# EAGLE design TeensyAmp_R4.2 (EAGLE 9.6.2)

## Sheet 1 of 3
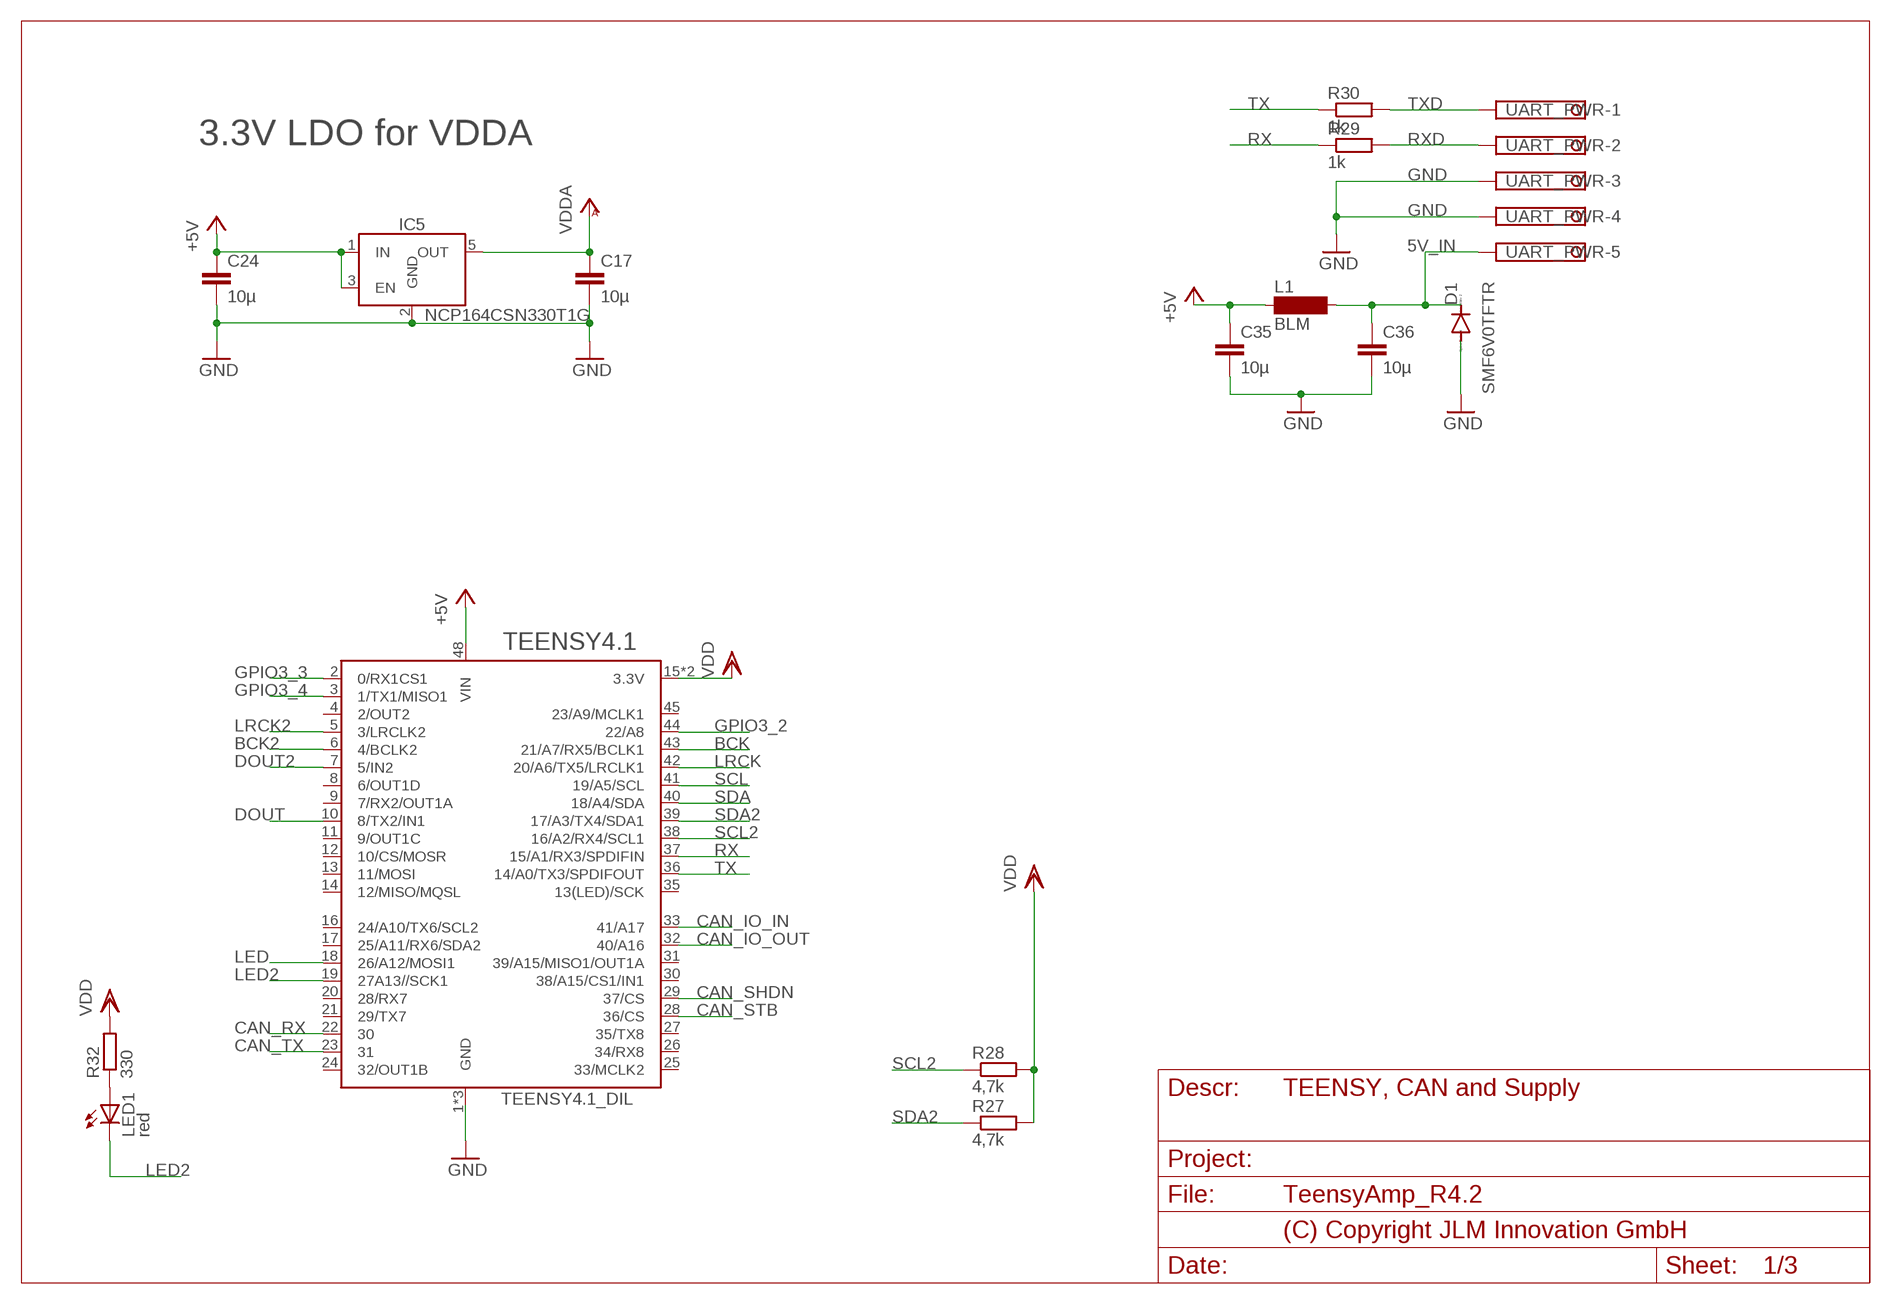
[diagram p0: schematic, sheet 1]
FRAME2 (DINA4_L): PAGE_DESCRIPTION: TEENSY, CAN and Supply

### Parts
C17  10µ  C-EUC0603  [C0603]
C24  10µ  C-EUC0603  [C0603]
C35  10µ  C-EUC0805  [C0805]
C36  10µ  C-EUC0805  [C0805]
D1  SMF6V0TFTR  DIODE-SOD123  [SOD123]
IC5  NCP164CSN330T1G  LDO_ENSOT23-5  [SOT23-5]
L1  BLM  L_JLM0805  [R0805]
LED1  red  LED5MM  [LED5MM]
R27  4,7k  R_JLMR0603  [R0603]
R28  4,7k  R_JLMR0603  [R0603]
R29  1k  R_JLMR0603  [R0603]
R30  1k  R_JLMR0603  [R0603]
R32  330  R_JLMR0603  [R0603]
TEENSY4.1  TEENSY4.1_DIL  [TEENSY4.1_DIL]
UART_PWR  1751277  [1751277]

### Nets
5V_IN: C36.1 D1.C L1.2 UART_PWR.5
+5V: C24.1 C35.1 IC5.1(IN) IC5.3(EN) L1.1 TEENSY4.1.48(VIN)
BCK: TEENSY4.1.43(21/A7/RX5/BCLK1)
BCK2: TEENSY4.1.6(4/BCLK2) ; also sheet 2,3
CAN_IO_IN: TEENSY4.1.33(41/A17)
CAN_IO_OUT: TEENSY4.1.32(40/A16)
CAN_RX: TEENSY4.1.22
CAN_SHDN: TEENSY4.1.29(37/CS)
CAN_STB: TEENSY4.1.28(36/CS)
CAN_TX: TEENSY4.1.23
DOUT: TEENSY4.1.10(8/TX2/IN1)
DOUT2: TEENSY4.1.7(5/IN2) ; also sheet 2,3
GND: C17.2 C24.2 C35.2 C36.2 D1.A IC5.2(GND) TEENSY4.1.1(GND) TEENSY4.1.34(GND) TEENSY4.1.47(GND) UART_PWR.3 UART_PWR.4 ; also sheet 2,3
GPIO3_2: TEENSY4.1.44(22/A8)
GPIO3_3: TEENSY4.1.2(0/RX1CS1) ; also sheet 2
GPIO3_4: TEENSY4.1.3(1/TX1/MISO1) ; also sheet 3
LED: TEENSY4.1.18(26/A12/MOSI1)
LED2: LED1.K(C) TEENSY4.1.19(27A13//SCK1)
LRCK: TEENSY4.1.42(20/A6/TX5/LRCLK1)
LRCK2: TEENSY4.1.5(3/LRCLK2) ; also sheet 2,3
N$71: LED1.A R32.1
RX: R29.1 TEENSY4.1.37(15/A1/RX3/SPDIFIN)
RXD: R29.2 UART_PWR.2
SCL: TEENSY4.1.41(19/A5/SCL)
SCL2: R28.1 TEENSY4.1.38(16/A2/RX4/SCL1) ; also sheet 2,3
SDA: TEENSY4.1.40(18/A4/SDA)
SDA2: R27.1 TEENSY4.1.39(17/A3/TX4/SDA1) ; also sheet 2,3
TX: R30.1 TEENSY4.1.36(14/A0/TX3/SPDIFOUT)
TXD: R30.2 UART_PWR.1
VDD: R27.2 R28.2 R32.2 TEENSY4.1.15(3.3V) TEENSY4.1.46(3.3V) ; also sheet 2,3
VDDA: C17.1 IC5.5(OUT) ; also sheet 2,3
Unconnected: TEENSY4.1.4(2/OUT2) TEENSY4.1.8(6/OUT1D) TEENSY4.1.9(7/RX2/OUT1A) TEENSY4.1.11(9/OUT1C) TEENSY4.1.12(10/CS/MOSR) TEENSY4.1.13(11/MOSI) TEENSY4.1.14(12/MISO/MQSL) TEENSY4.1.16(24/A10/TX6/SCL2) TEENSY4.1.17(25/A11/RX6/SDA2) TEENSY4.1.20(28/RX7) TEENSY4.1.21(29/TX7) TEENSY4.1.24(32/OUT1B) TEENSY4.1.25(33/MCLK2) TEENSY4.1.26(34/RX8) TEENSY4.1.27(35/TX8) TEENSY4.1.30(38/A15/CS1/IN1) TEENSY4.1.31(39/A15/MISO1/OUT1A) TEENSY4.1.35(13(LED)/SCK) TEENSY4.1.45(23/A9/MCLK1)

### Notes on the sheet
- 3.3V LDO for VDDA

## Sheet 2 of 3
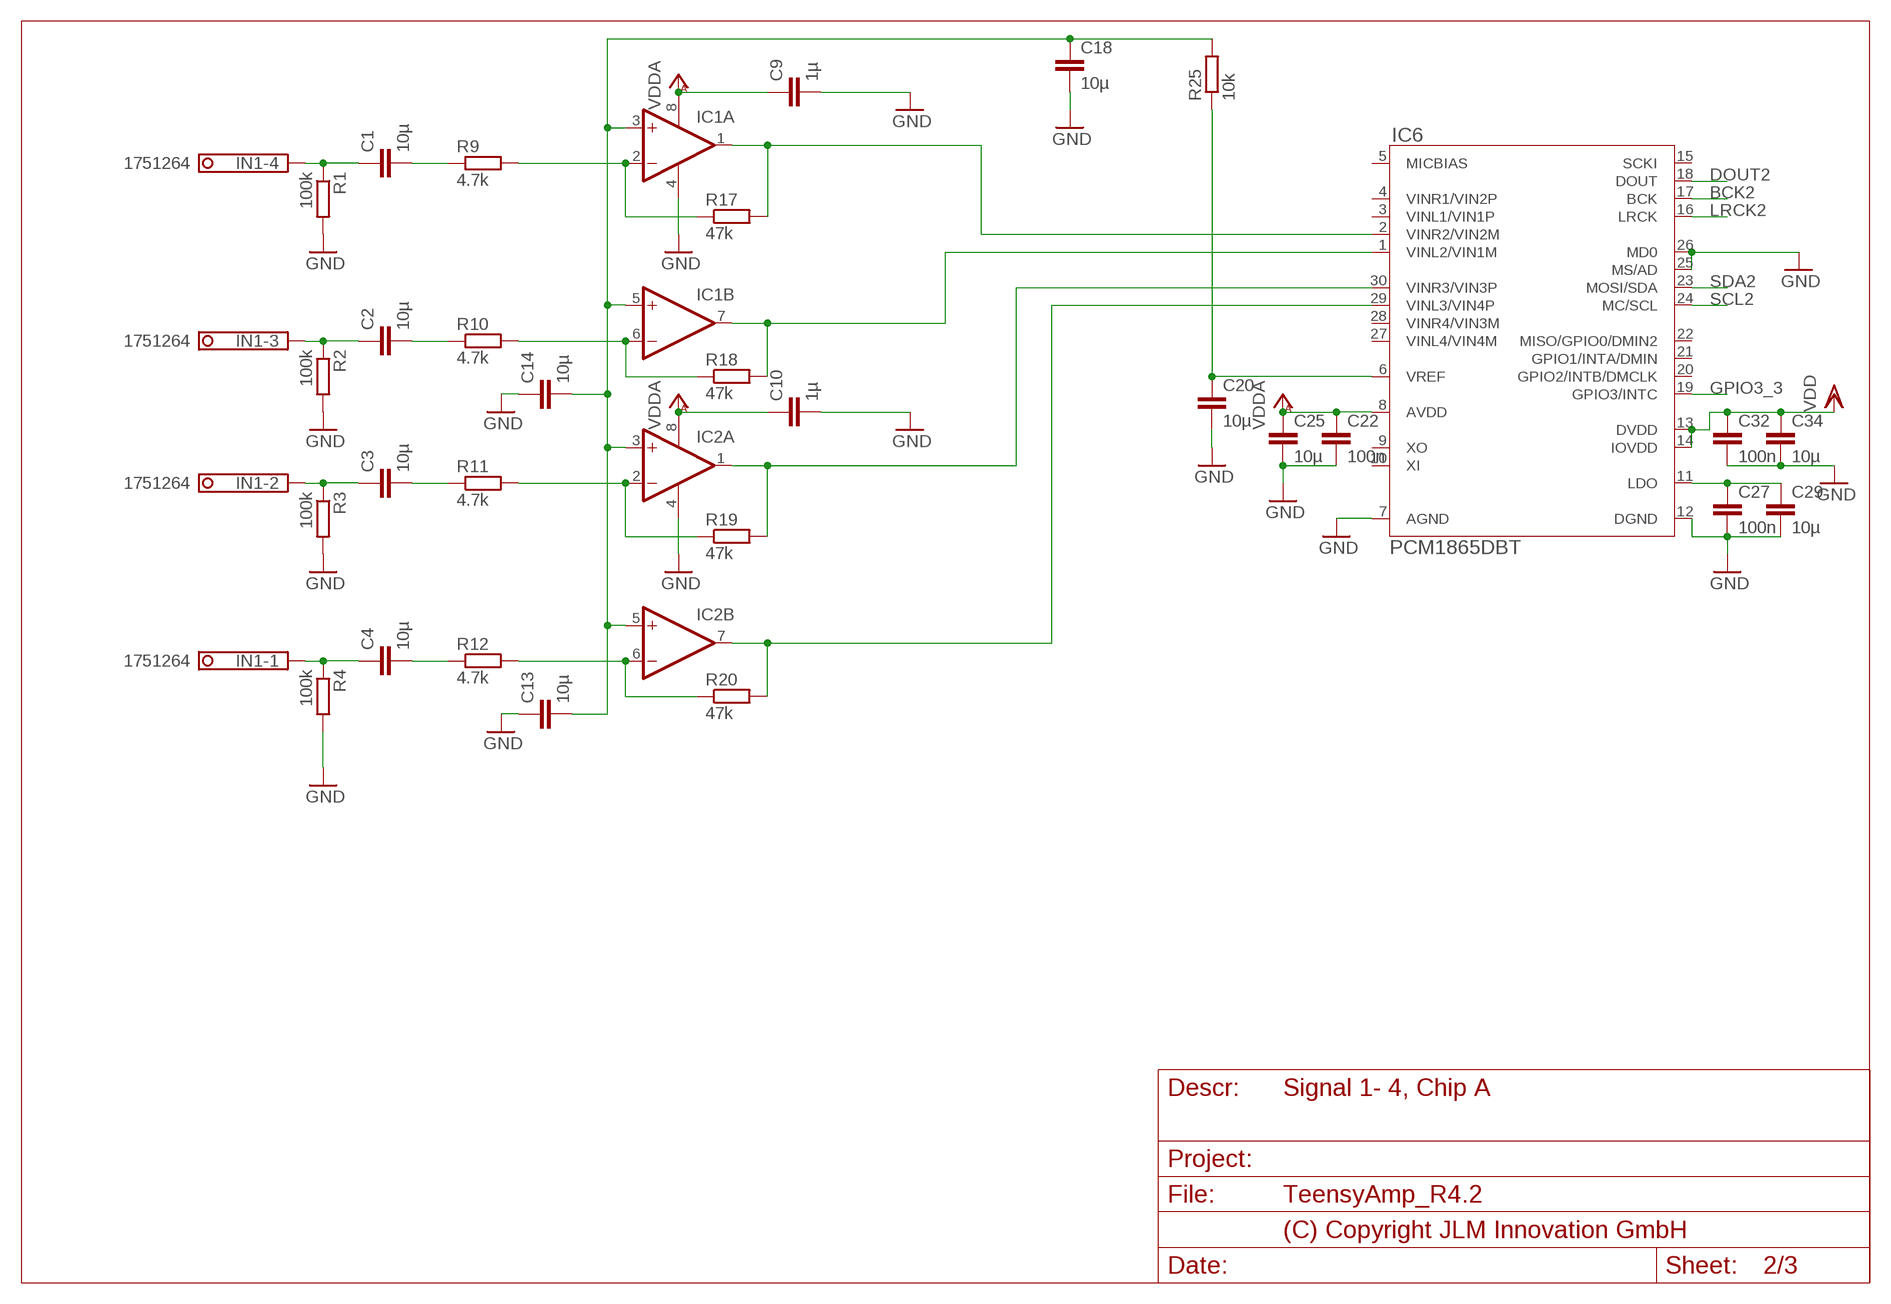
[diagram p1: schematic, sheet 2]
FRAME1 (DINA4_L): PAGE_DESCRIPTION: Signal 1- 4, Chip A

### Parts
C1  10µ  C-EUC0805  [C0805]
C2  10µ  C-EUC0805  [C0805]
C3  10µ  C-EUC0805  [C0805]
C4  10µ  C-EUC0805  [C0805]
C9  1µ  C-EUC0603  [C0603]
C10  1µ  C-EUC0603  [C0603]
C13  10µ  C-EUC0603  [C0603]
C14  10µ  C-EUC0603  [C0603]
C18  10µ  C-EUC0603  [C0603]
C20  10µ  C-EUC0603  [C0603]
C22  100n  C-EUC0603  [C0603]
C25  10µ  C-EUC0603  [C0603]
C27  100n  C-EUC0603  [C0603]
C29  10µ  C-EUC0603  [C0603]
C32  100n  C-EUC0603  [C0603]
C34  10µ  C-EUC0603  [C0603]
IC1  OPA2344E  [MSOP08]
IC2  OPA2344E  [MSOP08]
IC6  PCM1865DBT  [SOP50P640X120-30N]
IN1  1751264  [1751264]
R1  100k  R_JLMR0603  [R0603]
R2  100k  R_JLMR0603  [R0603]
R3  100k  R_JLMR0603  [R0603]
R4  100k  R_JLMR0603  [R0603]
R9  4.7k  R_JLMR0603  [R0603]
R10  4.7k  R_JLMR0603  [R0603]
R11  4.7k  R_JLMR0603  [R0603]
R12  4.7k  R_JLMR0603  [R0603]
R17  47k  R_JLMR0603  [R0603]
R18  47k  R_JLMR0603  [R0603]
R19  47k  R_JLMR0603  [R0603]
R20  47k  R_JLMR0603  [R0603]
R25  10k  R_JLMR0603  [R0603]

### Nets
BCK2: IC6.17(BCK) ; also sheet 1,3
DOUT2: IC6.18(DOUT) ; also sheet 1,3
GND: C9.2 C10.2 C13.1 C14.1 C18.2 C20.2 C22.2 C25.2 C27.2 C29.2 C32.2 C34.2 IC1.4(A:V-) IC2.4(A:V-) IC6.7(AGND) IC6.12(DGND) IC6.25(MS/AD) IC6.26(MD0) R1.2 R2.2 R3.2 R4.2 ; also sheet 1,3
GPIO3_3: IC6.19(GPIO3/INTC) ; also sheet 1
LRCK2: IC6.16(LRCK) ; also sheet 1,3
N$11: C27.1 C29.1 IC6.11(LDO)
N$16: C4.1 IN1.1 R4.1
N$18: C3.1 IN1.2 R3.1
N$19: C2.1 IN1.3 R2.1
N$21: C1.1 IN1.4 R1.1
N$23: C2.2 R10.1
N$24: C3.2 R11.1
N$25: C1.2 R9.1
N$26: C4.2 R12.1
N$28: IC1.1(A:OUT) IC6.2(VINR2/VIN2M) R17.2
N$29: IC1.7(B:OUT) IC6.1(VINL2/VIN1M) R18.2
N$30: IC2.1(A:OUT) IC6.30(VINR3/VIN3P) R19.2
N$31: IC1.2(A:-IN) R9.2 R17.1
N$32: IC1.6(B:-IN) R10.2 R18.1
N$33: IC2.2(A:-IN) R11.2 R19.1
N$34: IC2.6(B:-IN) R12.2 R20.1
N$35: IC2.7(B:OUT) IC6.29(VINL3/VIN4P) R20.2
N$37: C20.1 IC6.6(VREF) R25.1
N$74: C13.2 C14.2 C18.1 IC1.3(A:+IN) IC1.5(B:+IN) IC2.3(A:+IN) IC2.5(B:+IN) R25.2
SCL2: IC6.24(MC/SCL) ; also sheet 1,3
SDA2: IC6.23(MOSI/SDA) ; also sheet 1,3
VDD: C32.1 C34.1 IC6.13(DVDD) IC6.14(IOVDD) ; also sheet 1,3
VDDA: C9.1 C10.1 C22.1 C25.1 IC1.8(A:V+) IC2.8(A:V+) IC6.8(AVDD) ; also sheet 1,3
Unconnected: IC6.3(VINL1/VIN1P) IC6.4(VINR1/VIN2P) IC6.5(MICBIAS) IC6.9(XO) IC6.10(XI) IC6.15(SCKI) IC6.20(GPIO2/INTB/DMCLK) IC6.21(GPIO1/INTA/DMIN) IC6.22(MISO/GPIO0/DMIN2) IC6.27(VINL4/VIN4M) IC6.28(VINR4/VIN3M)

## Sheet 3 of 3
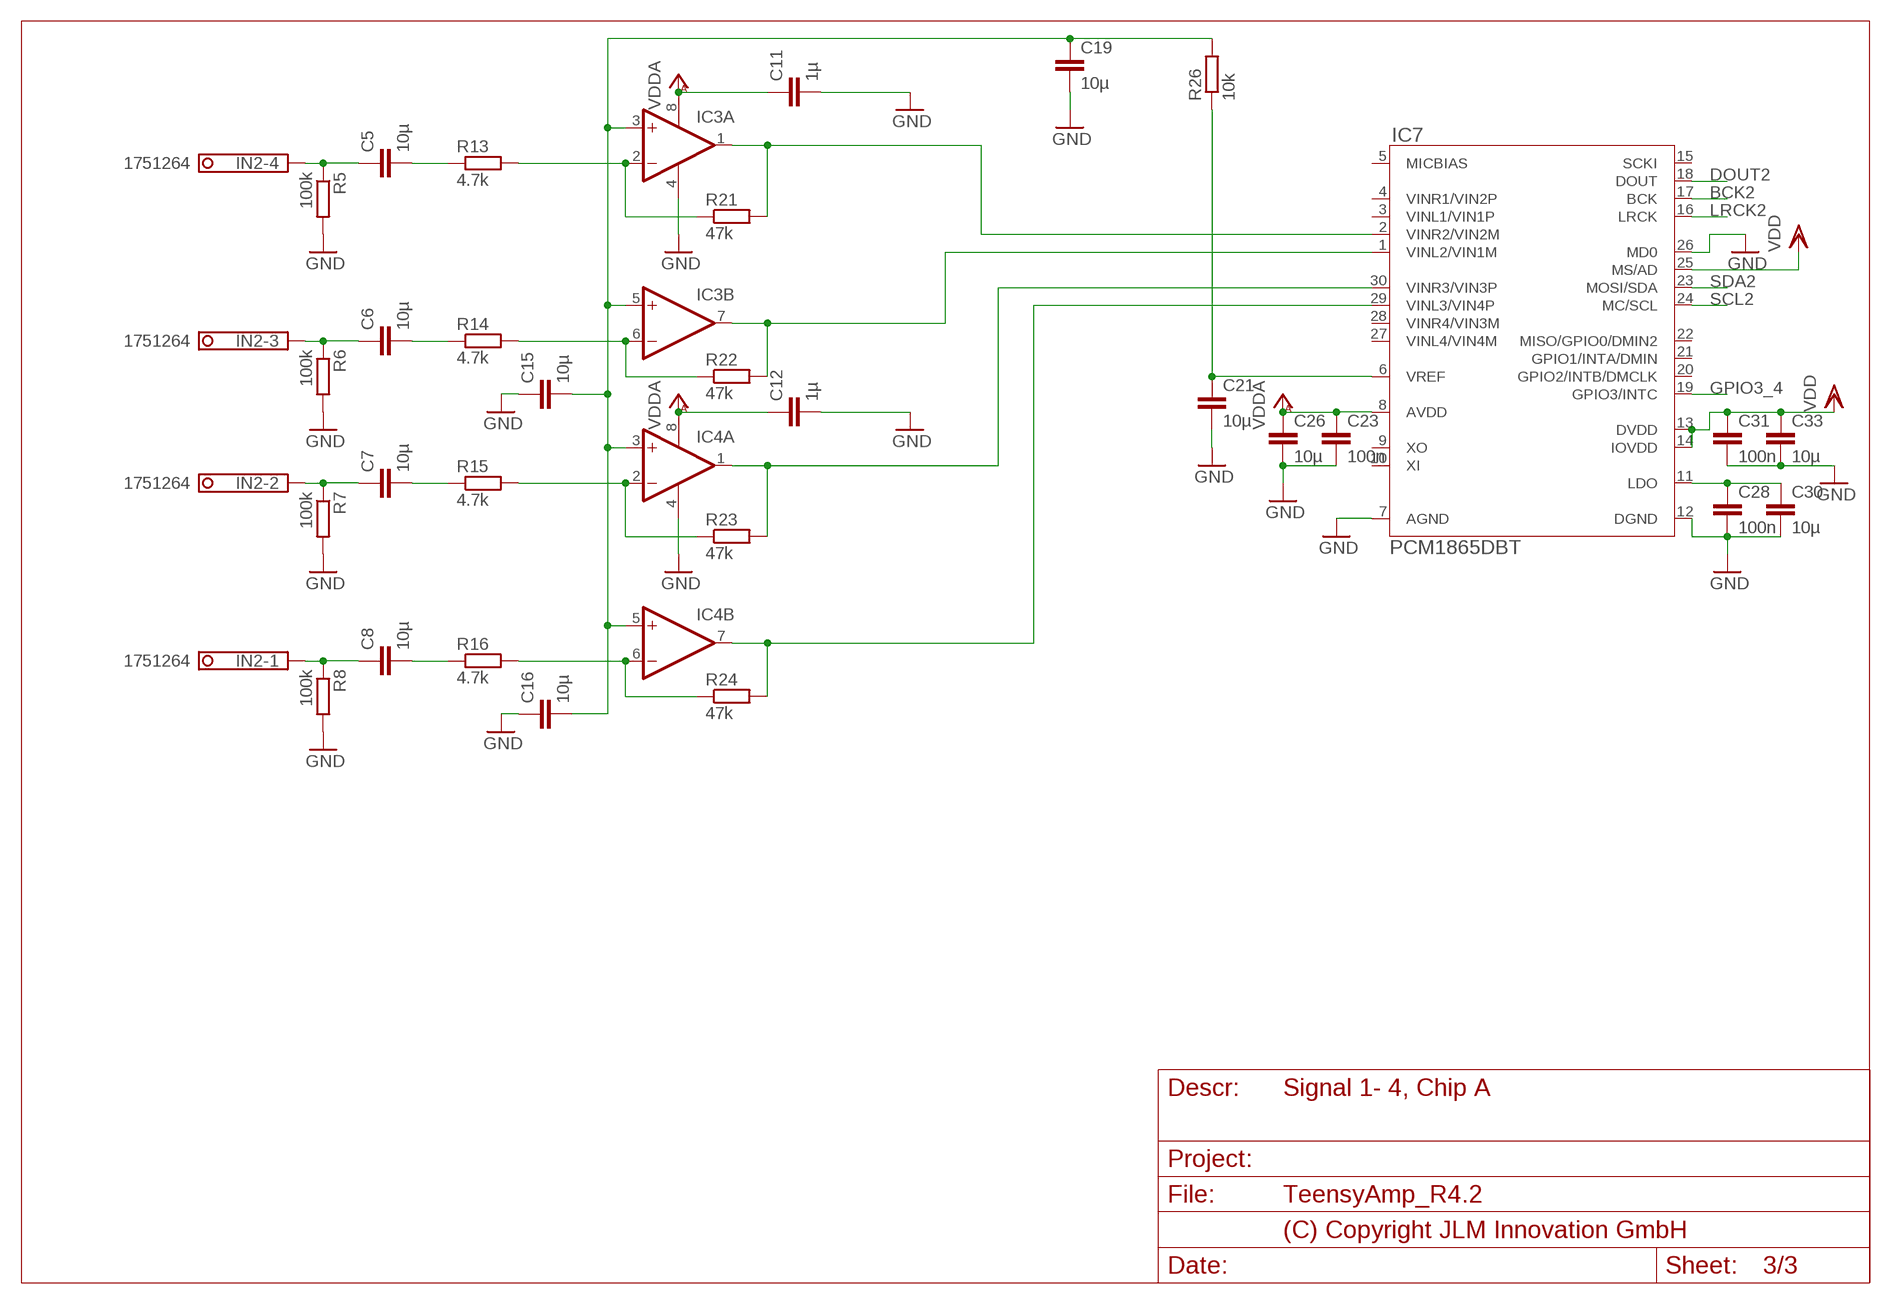
[diagram p2: schematic, sheet 3]
FRAME3 (DINA4_L): PAGE_DESCRIPTION: Signal 1- 4, Chip A

### Parts
C5  10µ  C-EUC0805  [C0805]
C6  10µ  C-EUC0805  [C0805]
C7  10µ  C-EUC0805  [C0805]
C8  10µ  C-EUC0805  [C0805]
C11  1µ  C-EUC0603  [C0603]
C12  1µ  C-EUC0603  [C0603]
C15  10µ  C-EUC0603  [C0603]
C16  10µ  C-EUC0603  [C0603]
C19  10µ  C-EUC0603  [C0603]
C21  10µ  C-EUC0603  [C0603]
C23  100n  C-EUC0603  [C0603]
C26  10µ  C-EUC0603  [C0603]
C28  100n  C-EUC0603  [C0603]
C30  10µ  C-EUC0603  [C0603]
C31  100n  C-EUC0603  [C0603]
C33  10µ  C-EUC0603  [C0603]
IC3  OPA2344E  [MSOP08]
IC4  OPA2344E  [MSOP08]
IC7  PCM1865DBT  [SOP50P640X120-30N]
IN2  1751264  [1751264]
R5  100k  R_JLMR0603  [R0603]
R6  100k  R_JLMR0603  [R0603]
R7  100k  R_JLMR0603  [R0603]
R8  100k  R_JLMR0603  [R0603]
R13  4.7k  R_JLMR0603  [R0603]
R14  4.7k  R_JLMR0603  [R0603]
R15  4.7k  R_JLMR0603  [R0603]
R16  4.7k  R_JLMR0603  [R0603]
R21  47k  R_JLMR0603  [R0603]
R22  47k  R_JLMR0603  [R0603]
R23  47k  R_JLMR0603  [R0603]
R24  47k  R_JLMR0603  [R0603]
R26  10k  R_JLMR0603  [R0603]

### Nets
BCK2: IC7.17(BCK) ; also sheet 1,2
DOUT2: IC7.18(DOUT) ; also sheet 1,2
GND: C11.2 C12.2 C15.1 C16.1 C19.2 C21.2 C23.2 C26.2 C28.2 C30.2 C31.2 C33.2 IC3.4(A:V-) IC4.4(A:V-) IC7.7(AGND) IC7.12(DGND) IC7.26(MD0) R5.2 R6.2 R7.2 R8.2 ; also sheet 1,2
GPIO3_4: IC7.19(GPIO3/INTC) ; also sheet 1
LRCK2: IC7.16(LRCK) ; also sheet 1,2
N$43: C28.1 C30.1 IC7.11(LDO)
N$48: IC3.2(A:-IN) R13.2 R21.1
N$49: IC3.6(B:-IN) R14.2 R22.1
N$50: IC4.2(A:-IN) R15.2 R23.1
N$51: IC4.6(B:-IN) R16.2 R24.1
N$52: C6.2 R14.1
N$53: C7.2 R15.1
N$54: C8.2 R16.1
N$55: C5.2 R13.1
N$56: C8.1 IN2.1 R8.1
N$57: C7.1 IN2.2 R7.1
N$58: C6.1 IN2.3 R6.1
N$59: C5.1 IN2.4 R5.1
N$65: C21.1 IC7.6(VREF) R26.1
N$66: IC4.1(A:OUT) IC7.30(VINR3/VIN3P) R23.2
N$67: IC3.7(B:OUT) IC7.1(VINL2/VIN1M) R22.2
N$68: IC3.1(A:OUT) IC7.2(VINR2/VIN2M) R21.2
N$69: IC4.7(B:OUT) IC7.29(VINL3/VIN4P) R24.2
N$70: C15.2 C16.2 C19.1 IC3.3(A:+IN) IC3.5(B:+IN) IC4.3(A:+IN) IC4.5(B:+IN) R26.2
SCL2: IC7.24(MC/SCL) ; also sheet 1,2
SDA2: IC7.23(MOSI/SDA) ; also sheet 1,2
VDD: C31.1 C33.1 IC7.13(DVDD) IC7.14(IOVDD) IC7.25(MS/AD) ; also sheet 1,2
VDDA: C11.1 C12.1 C23.1 C26.1 IC3.8(A:V+) IC4.8(A:V+) IC7.8(AVDD) ; also sheet 1,2
Unconnected: IC7.3(VINL1/VIN1P) IC7.4(VINR1/VIN2P) IC7.5(MICBIAS) IC7.9(XO) IC7.10(XI) IC7.15(SCKI) IC7.20(GPIO2/INTB/DMCLK) IC7.21(GPIO1/INTA/DMIN) IC7.22(MISO/GPIO0/DMIN2) IC7.27(VINL4/VIN4M) IC7.28(VINR4/VIN3M)

## Library data of the parts
C1-C36 = jlm_cap:C-EU: CAPACITOR, European symbol
D1 = jlm_diode:DIODE-: DIODE; OC_FARNELL: 2989529
IC1-IC4 = jlm_linear:OPA2*: Dual Operational Amplifier Low Power, Single-Supply, Rail-To-Rail Operational Amplifier Source: http://focus.ti.com/lit/ds/symlink/opa2345.pdf http://focus.ti.com .. opa241.pdf http://focus.ti.com/lit/ds/symlink/opa2134.pdf
IC5 = jlm_power:LDO_EN; OC_FARNELL: 3367831; OC_MOUSER: 863-NCP164CSN330T1G
IC6 IC7 = jlm_adc_dac:PCM1865: PCM1865 4-Channel, 192-kHz, Audio ADCs; OC_MOUSER: 595-PCM1865DBT
IN1 = jlm_con:1751264: MKDS 1/ 4-3,5 Printklemme Nennstrom: 10 A Bemessungsspannung: 160 V Raster: 3,5 mm Polzahl: 4 Montageart: Löten Anschlussart: Schraubanschluss Anschlussrichtung vom Leiter zur Platine: 0° Source: http://eshop.phoenixcontact.com .. 1751264.pdf; MPN: 1751264; OC_FARNELL: 2478588; OC_NEWARK: 10R0934
IN2 = jlm_con:1751264: MKDS 1/ 4-3,5 Printklemme Nennstrom: 10 A Bemessungsspannung: 160 V Raster: 3,5 mm Polzahl: 4 Montageart: Löten Anschlussart: Schraubanschluss Anschlussrichtung vom Leiter zur Platine: 0° Source: http://eshop.phoenixcontact.com .. 1751264.pdf; MPN: 1751264; OC_FARNELL: 2478588; OC_NEWARK: 10R0934; OC_RS: 8024852
L1 = jlm_inductor:L_JLM
LED1 = jlm_optical:LED: LED OSRAM: - CHIPLED LG R971, LG N971, LY N971, LG Q971, LY Q971, LO R971, LY R971 LH N974, LH R974 LS Q976, LO Q976, LY Q976 LO Q996 - Hyper CHIPLED LW Q18S LB Q993, LB Q99A, LB R99A - SideLED LS A670, LO A670, LY A670, LG A670, LP A670 LB A673, LV A673, LT A673, LW A673 LH A674 LY A675 LS A676, LA A676, LO A676, LY A676, LW A676 LS A679, LY A679, LG A679 - Hyper Micro SIDELED® LS Y876, LA Y876, LO Y876, LY Y876 LT Y87S - SmartLED LW L88C, LW L88S LB L89C, LB L89S, LG L890 LS L89K, LO L89K, LY L89K LS L896, LA L896, LO L896, LY L896 - TOPLED LS T670, LO T670, LY T670, LG T670, LP T670 LSG T670, LSP T670, LSY T670, LOP T670, LYG T670 LG T671, LOG T671, LSG T671 LB T673, LV T673, LT T673, LW T673 LH T674 LS T676, LA T676, LO T676, LY T676, LB T676, LH T676, LSB T676, LW T676 LB T67C, LV T67C, LT T67C, LS T67K, LO T67K, LY T67K, LW E67C LS E67B, LA E67B, LO E67B, LY E67B, LB E67C, LV E67C, LT E67C LW T67C LS T679, LY T679, LG T679 LS T770, LO T770, LY T770, LG T770, LP T770 LB T773, LV T773, LT T773, LW T773 LH T774 LS E675, LA E675, LY E675, LS T675 LS T776, LA T776, LO T776, LY T776, LB T776 LHGB T686 LT T68C, LB T68C - Hyper Mini TOPLED® LB M676 - Mini TOPLED Santana® LG M470 LS M47K, LO M47K, LY M47K Source: http://www.osram.convergy.de LUXEON: - LUMILED® LXK2-PW12-R00, LXK2-PW12-S00, LXK2-PW14-U00, LXK2-PW14-V00 LXK2-PM12-R00, LXK2-PM12-S00, LXK2-PM14-U00 LXK2-PE12-Q00, LXK2-PE12-R00, LXK2-PE12-S00, LXK2-PE14-T00, LXK2-PE14-U00 LXK2-PB12-K00, LXK2-PB12-L00, LXK2-PB12-M00, LXK2-PB14-N00, LXK2-PB14-P00, LXK2-PB14-Q00 LXK2-PR12-L00, LXK2-PR12-M00, LXK2-PR14-Q00, LXK2-PR14-R00 LXK2-PD12-Q00, LXK2-PD12-R00, LXK2-PD12-S00 LXK2-PH12-R00, LXK2-PH12-S00 LXK2-PL12-P00, LXK2-PL12-Q00, LXK2-PL12-R00 Source: www.luxeon.com KINGBRIGHT: KA-3528ASYC Source: www.kingbright.com
R1-R30 R32 = jlm_resistors:R_JLM: RESISTOR, European symbol
TEENSY4.1 = jlm_micro:TEENSY4.1_DIL
UART_PWR = jlm_con:1751277: MKDS 1/ 5-3,5 Printklemme Nennstrom: 10 A Bemessungsspannung: 160 V Raster: 3,5 mm Polzahl: 5 Montageart: Löten Anschlussart: Schraubanschluss Anschlussrichtung vom Leiter zur Platine: 0° Source: http://eshop.phoenixcontact.com .. 1751277.pdf; OC_FARNELL: unknown; OC_NEWARK: unknown; OC_RS: 8024855

## Board
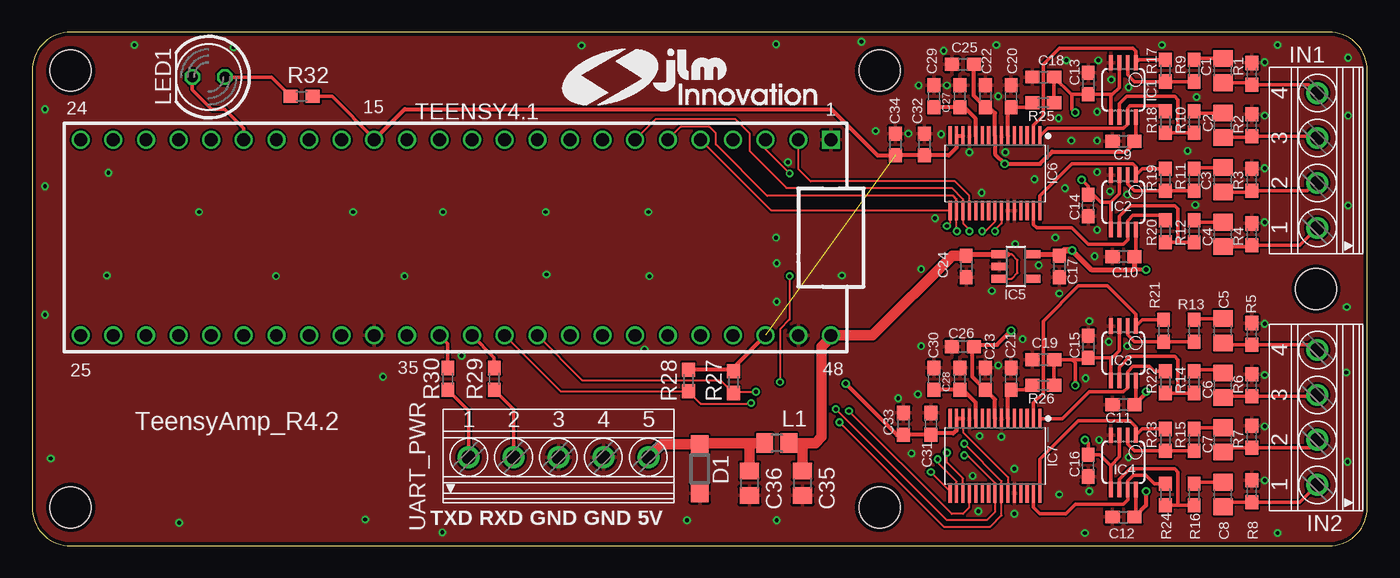
[diagram p3: board, top side]
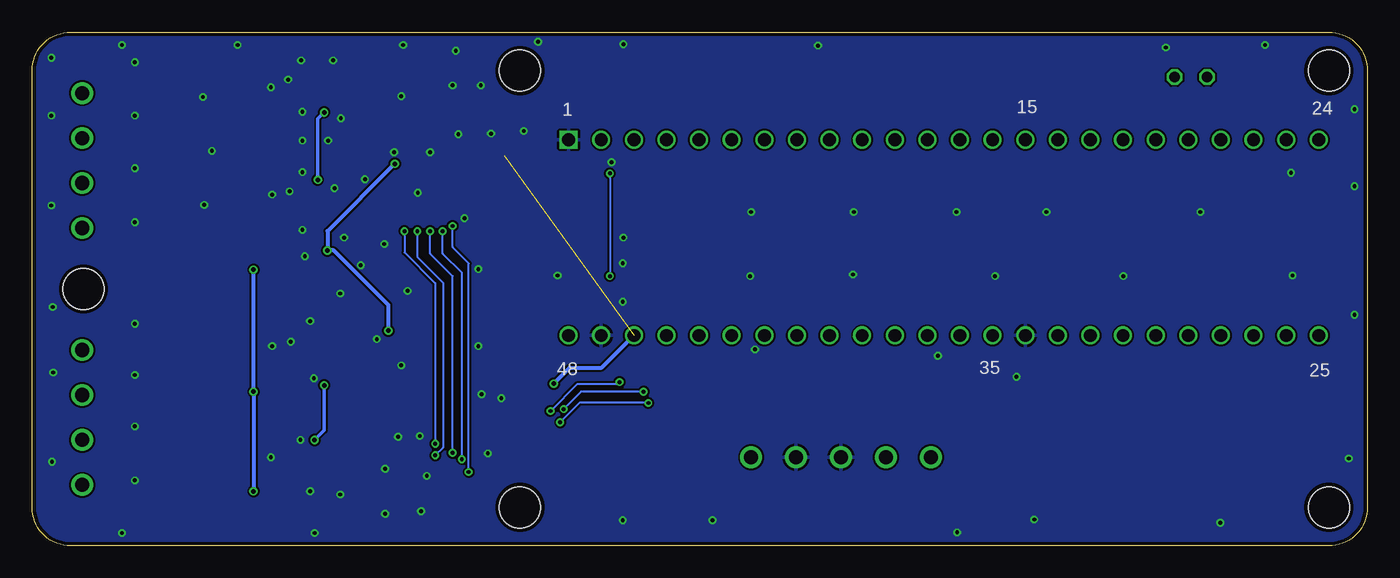
[diagram p4: board, bottom side, seen from below]

Size 104 x 40 mm. Coordinates in mm from the lower left corner, seen from the top.
Outline: 0,3 arc90 3,0 101,0 arc90 104,3 104,37 arc90 101,40 3,40 arc90 0,37 0,3
Copper layers (1*16): Top 0.035mm / dielectric 1.5mm / Bottom 0.035mm
Design rules "PCB-POOL Standard": minimum track width 0.15mm, minimum drill 0.3mm, track to track 0.15mm, track to pad 0.15mm, pad to pad 0.15mm, via to via 0.15mm, smd to smd 0.15mm, copper to edge 0.3mm, drill to drill 0.2mm, minimum pad ring 0.2mm, minimum via ring 0.15mm, stop-mask expansion 0.03mm, vias tented up to drill 0mil, thermal gap 0.2mm
Holes 3.2 mm at 3,3 66,3 3,37 66,37 100,20

### Footprints (pad centres in the part's own frame; a part is rotated, then mirrored left to right if it is on the bottom)
C0805 = smd 1.3 x 1.5: 1 -0.95,0; 2 0.95,0
C0603 = smd 1.1 x 1: 1 -0.85,0; 2 0.85,0
SOD123 = smd 1.4 x 1.4: A 1.9,0; C -1.9,0
MSOP08 = smd 0.3 x 1.2: 1 -0.976,-2.113; 2 -0.326,-2.113; 3 0.324,-2.113; 4 0.974,-2.113; 5 0.974,2.112; 6 0.324,2.112; 7 -0.326,2.112; 8 -0.976,2.112
SOT23-5 = smd 0.6 x 1.2: 1 -0.95,-1.306; 2 0,-1.306; 3 0.95,-1.306; 4 0.95,1.306; 5 -0.95,1.306
SOP50P640X120-30N = smd 1.5 x 0.3: 1 -2.9,3.5; 2 -2.9,3; 3 -2.9,2.5; 4 -2.9,2; 5 -2.9,1.5; 6 -2.9,1; 7 -2.9,0.5; 8 -2.9,0; 9 -2.9,-0.5; 10 -2.9,-1; 11 -2.9,-1.5; 12 -2.9,-2; 13 -2.9,-2.5; 14 -2.9,-3; 15 -2.9,-3.5; 16 2.9,-3.5; 17 2.9,-3; 18 2.9,-2.5; 19 2.9,-2; 20 2.9,-1.5; 21 2.9,-1; 22 2.9,-0.5; 23 2.9,0; 24 2.9,0.5; 25 2.9,1; 26 2.9,1.5; 27 2.9,2; 28 2.9,2.5; 29 2.9,3; 30 2.9,3.5
1751264 = drill 1.1 pad 1.7: 1 -5.25,-0.1; 2 -1.75,-0.1; 3 1.75,-0.1; 4 5.25,-0.1
R0805 = smd 1.3 x 1.5: 1 -0.95,0; 2 0.95,0
LED5MM = drill 0.813 octagon: A -1.27,0; K 1.27,0
R0603 = smd 1.1 x 1: 1 -0.85,0; 2 0.85,0
TEENSY4.1_DIL = drill 1 square: 1 -29.21,-7.62 | drill 1: 2 -26.67,-7.62; 3 -24.13,-7.62; 4 -21.59,-7.62; 5 -19.05,-7.62; 6 -16.51,-7.62; 7 -13.97,-7.62; 8 -11.43,-7.62; 9 -8.89,-7.62; 10 -6.35,-7.62; 11 -3.81,-7.62; 12 -1.27,-7.62; 13 1.27,-7.62; 14 3.81,-7.62; 15 6.35,-7.62; 16 8.89,-7.62; 17 11.43,-7.62; 18 13.97,-7.62; 19 16.51,-7.62; 20 19.05,-7.62; 21 21.59,-7.62; 22 24.13,-7.62; 23 26.67,-7.62; 24 29.21,-7.62; 25 29.21,7.62; 26 26.67,7.62; 27 24.13,7.62; 28 21.59,7.62; 29 19.05,7.62; 30 16.51,7.62; 31 13.97,7.62; 32 11.43,7.62; 33 8.89,7.62; 34 6.35,7.62; 35 3.81,7.62; 36 1.27,7.62; 37 -1.27,7.62; 38 -3.81,7.62; 39 -6.35,7.62; 40 -8.89,7.62; 41 -11.43,7.62; 42 -13.97,7.62; 43 -16.51,7.62; 44 -19.05,7.62; 45 -21.59,7.62; 46 -24.13,7.62; 47 -26.67,7.62; 48 -29.21,7.62
1751277 = drill 1.1 pad 1.7: 1 -7,-0.1; 2 -3.5,-0.1; 3 0,-0.1; 4 3.5,-0.1; 5 7,-0.1

### Placement (x,y rotation side)
C1  92.75,37 90 top
C2  92.75,32.75 90 top
C3  92.75,28.5 90 top
C4  92.75,24.25 90 top
C5  92.75,16.75 90 top
C6  92.75,12.5 90 top
C7  92.75,8.25 90 top
C8  92.75,4 90 top
C9  85,31.5 180 top
C10  85,22.5 180 top
C11  85,11 180 top
C12  85,2.25 180 top
C13  82.25,36 270 top
C14  82.25,26.5 90 top
C15  82.25,15.5 270 top
C16  82.25,6.25 90 top
C17  80,21.75 270 top
C18  78.75,36.5 180 top
C19  78.75,14.5 180 top
C20  76.25,35 90 top
C21  76.25,13 90 top
C22  74.25,35 90 top
C23  74.25,13 90 top
C24  72.75,21.75 270 top
C25  72.5,37.5 180 top
C26  72.5,15.5 180 top
C27  72.25,35 90 top
C28  72.25,13 90 top
C29  70.25,35 90 top
C30  70.25,13 90 top
C31  70,9.5 90 top
C32  69.5,31.25 90 top
C33  67.88,9.5 90 top
C34  67.25,31.25 90 top
C35  60,4.88 270 top
C36  55.88,4.88 270 top
D1  52,6 270 top
IC1  85,35.5 180 top
IC2  85,26.75 180 top
IC3  85,15 180 top
IC4  85,6.5 180 top
IC5  76.62,21.75 270 top
IC6  75,29 270 top
IC7  75,7 270 top
IN1  100,30 90 top
IN2  100,10 90 top
L1  58,8 180 top
LED1  13.75,36.5 180 top
R1  95,36.75 90 top
R2  95,32.75 90 top
R3  95,28.5 90 top
R4  95,24.25 90 top
R5  95,16.5 90 top
R6  95,12.5 90 top
R7  95,8.5 90 top
R8  95,4.25 90 top
R9  90.5,37 270 top
R10  90.5,33 270 top
R11  90.5,28.5 270 top
R12  90.5,24.5 270 top
R13  90.5,16.75 270 top
R14  90.5,12.75 270 top
R15  90.5,8.25 270 top
R16  90.5,4 270 top
R17  88.25,37 90 top
R18  88.25,33 90 top
R19  88.25,28.5 90 top
R20  88.25,24.5 90 top
R21  88.12,16.75 90 top
R22  88.25,12.75 90 top
R23  88.25,8.25 90 top
R24  88.25,4 90 top
R25  78.75,34.5 0 top
R26  78.75,12.5 0 top
R27  54.62,12.75 90 top
R28  51.12,12.88 90 top
R29  36,13 270 top
R30  32.38,13 270 top
R32  21,35 0 top
TEENSY4.1  33,24 180 top
U$1  [JLM_LOGO_MID]  41,34 0 top
UART_PWR  41,7 0 top

### Tracks (layer width: path | path; a pad name or v marks a point on that pad's centre or on a via)
5V_IN
  Top 0.813: UART_PWR.5 49,7.9 D1.C 52.1,8 55.88,8 | 55.88,8 L1.2 | C36.1 55.88,8
+5V
  Top 0.152: IC5.3 76.3,20.8 76.75,21.25 76.75,22.25 76.3,22.7 76,22.7 IC5.1
  Top 0.406: C24.1 72.85,22.7 76,22.7
  Top 0.813: C24.1 71.68,22.6 65.46,16.38 TEENSY4.1.48 62.21,16.23 61.49,15.51 61.49,8.49 61,8 60,8 | L1.1 60,8 | C35.1 60,8
BCK2  (via drill 0.3)
  Top 0.152: v70.53,6.75 70.53,6.5 72,5.03 IC7.17 | v72.03,24.5 72.03,24.78 72,24.75 IC6.17 72,27 71.75,27.25 57.25,27.25 53.25,31.25 53.25,32.12 52.75,32.62 50.52,32.62 TEENSY4.1.6
  Bottom 0.152: v70.53,6.75 70.53,21.25 72.03,22.75 v72.03,24.5
DOUT2  (via drill 0.3)
  Top 0.152: IC7.18 72.5,5.25 71.25,6.5 v71.25,7.25 | v73,24.5 73,24.6 72.5,25.1 IC6.18 72.5,27 71.62,27.88 58.75,27.88 55.88,30.75 55.88,32.12 54.75,33.25 48.6,33.25 TEENSY4.1.7
  Bottom 0.152: v71.25,7.25 71.25,21 73,22.75 v73,24.5
GND  (via drill 0.3)
  other vias: 75.25,14.05 75.5,8.5 77.15,16.1 76.5,6 96,5.1 96,9.3 96,13.3 96,17.3 83.85,15.9 82.05,13.05 83.1,8.25 85.4,6.9 13,26 19,21 25,26 32,26 40,26 88,39 102.45,6.55 1,34 1,18 58.88,29.88 11.45,1.8 51,2 47.7,15.3 27.33,13.18 1.45,6.8 15.7,38.8 67.45,11.5 78.4,21.85 80,19.65 76.58,23.5 73,30.65 73.95,27.5 71.25,35.85 71,38.55 75.25,35 75.8,30.65 73.8,8.55 68.25,32.1 78.08,28.55 79.7,24 83.95,27.6 84.05,36.3 85.4,35.7 85.3,27.35 90,30.75 96,29.4 96,25.2 96,33.5 96,37.65 102.5,33.5 102.4,18.6 90.6,26.55 90.7,34.95 97,1 82,1 102.5,38 97,39 102.5,26.5 102.35,13.5 1,28 75.1,39 64.6,39.25 7.97,39 48,26 73.7,2.7 42.8,38.95 85.3,15.55 82.75,22.55 74.75,19.85 68.5,7.2 69.05,35.85 70.8,32.05 65.7,32.3 33.45,14.8 29,21 5.82,21.05 5.95,29.05 82.95,33.8 79.95,33.3 80.55,37.8 83.05,37.8 82.95,29.1 80.45,27.85 82.95,31.55 80.95,31.55 82.95,24.6 76.5,2.5 69.25,21.55 69.25,15.55 31.95,1.05 25.95,2.05 58,22 63.08,21.05 58,2 57.95,39.05 82.35,4.25 80,4 82.35,17.5 69,11.8 73.25,5.45 58,19 70.33,25.5 57.95,24 40.08,21.12 48.08,21
  pour Top: 0,0 0,40 104,40 104,0
  pour Bottom: 0,0 0,40 104,40 104,0
GPIO3_3
  Top 0.152: IC6.19 73,27.25 71.88,28.38 60.62,28.38 59.67,29.33 TEENSY4.1.2
GPIO3_4  (via drill 0.3)
  Top 0.152: IC7.19 73,3 72.5,2.5 71.62,2.5 v63.62,10.5 | TEENSY4.1.3 57.13,30.87 v59,29 | v58.25,12.75 58.25,16.88 59,17.62 v59,21
  Bottom 0.152: v59,29 v59,21 | v58.25,12.75 58.38,12.62 61.5,12.62 v63.62,10.5
LED2
  Top 0.254: LED1.K 12.48,35.52 14,34 15,34 16.49,32.51 TEENSY4.1.19
LRCK2  (via drill 0.3)
  Top 0.152: v71.25,24.9 71.5,25.15 IC6.16 57.57,26.1 TEENSY4.1.5 | IC7.16 71.5,4.25 v70,5.75
  Bottom 0.152: v70,5.75 70,22 71.25,23.25 v71.25,24.9
N$11
  Top 0.305: IC6.11 73.5,33.25 72.6,34.15 C27.1 C29.1
N$16
  Top 0.254: C4.1 94.9,23.3 R4.1 98.75,23.4 IN1.1
N$18
  Top 0.254: C3.1 94.9,27.55 R3.1 99.3,27.65 99.9,28.25 IN1.2
N$19
  Top 0.254: C2.1 94.9,31.8 R2.1 99.75,31.9 99.9,31.75 IN1.3
N$21
  Top 0.254: C1.1 94.85,36.05 R1.1 99.45,35.9 IN1.4
N$23
  Top 0.254: C2.2 90.65,33.7 R10.1
N$24
  Top 0.254: C3.2 90.6,29.45 R11.1
N$25
  Top 0.254: C1.2 90.6,37.95 R9.1
N$26
  Top 0.254: C4.2 90.65,25.2 R12.1
N$28
  Top 0.254: IC6.2 78,32.75 78.75,33.5 78.75,37.5 80,38.75 85.75,38.75 85.98,38.52 IC1.1 86.21,37.85 R17.2
N$29
  Top 0.254: IC6.1 79.1,32.5 85,32.5 85.33,32.83 IC1.7 85.33,34.08 85.52,34.27 87.83,34.27 R18.2
N$30
  Top 0.254: R19.2 86.46,29.35 IC2.1 85.98,29.52 85.75,29.75 81,29.75 78.5,27.25 IC6.30
N$31
  Top 0.254: R9.2 R17.1 85.85,36.15 85.33,36.67 IC1.2
N$32
  Top 0.254: R10.2 89.25,32.15 | 89.25,32.15 R18.1 | IC1.6 84.68,34.43 85.25,35 89,35 89.25,34.75 89.25,32.15
N$33
  Top 0.254: R11.2 R19.1 85.85,27.65 85.33,28.17 IC2.2
N$34
  Top 0.254: R20.1 89.25,23.65 | 89.25,23.65 R12.2 | IC2.6 84.68,25.68 85.5,26.5 89,26.5 89.25,26.25 89.25,23.65
N$35
  Top 0.254: R20.2 87.85,25.75 85.75,25.75 85.33,25.33 IC2.7 85.33,23.83 85,23.5 82.25,23.5 81,24.75 78.25,24.75 78,25 IC6.29
N$37
  Top 0.254: 76,33.82 76.25,34.07 C20.1 77.55,34.15 R25.1
  Top 0.305: IC6.6 76,33.82
N$43
  Top 0.305: IC7.11 73.5,11.15 72.5,12.15 C28.1 C30.1
N$48
  Top 0.254: IC3.2 85.33,16.42 85.85,15.9 R21.1 R13.2
N$49
  Top 0.254: R22.1 89.25,11.9 | 89.25,11.9 R14.2 | IC3.6 84.68,13.93 85.5,14.75 89,14.75 89.25,14.5 89.25,11.9
N$50
  Top 0.254: IC4.2 85.33,7.92 85.85,7.4 R23.1 R15.2
N$51
  Top 0.152: R24.1 89.25,3.15 R16.2
  Top 0.254: R16.2 R24.1 | 89.25,3.15 89.25,5.75 89,6 85.5,6 84.68,5.18 IC4.6
N$52
  Top 0.254: C6.2 92.5,13.7 90.6,13.7 R14.1
N$53
  Top 0.254: C7.2 90.6,9.2 R15.1
N$54
  Top 0.254: C8.2 90.6,4.95 R16.1
N$55
  Top 0.254: C5.2 90.6,17.7 R13.1
N$56
  Top 0.254: C8.1 93.1,3.4 R8.1 98.75,3.4 IN2.1
N$57
  Top 0.254: C7.1 93.1,7.65 R7.1 99.5,7.65 IN2.2
N$58
  Top 0.254: C6.1 92.85,11.65 R6.1 100,11.65 IN2.3
N$59
  Top 0.254: C5.1 92.9,15.65 R5.1 99.5,15.65 99.9,15.25 IN2.4
N$65
  Top 0.254: C21.1 77.3,12.15 77.65,12.5 R26.1
  Top 0.305: C21.1 76,12.15 IC7.6
N$66
  Top 0.254: R23.2 86.46,9.1 IC4.1 85.98,9.27 85.5,9.75 81.5,9.75 78.5,6.75 IC7.30
N$67
  Top 0.152: 85.33,13 IC3.7
  Top 0.254: R22.2 87.4,13.6 87,14 85.75,14 85.33,13.58 85.33,13 | IC7.1 80.25,9.9 82.35,12 85,12 85.33,12.33 IC3.7
N$68
  Top 0.254: R21.2 86.46,17.6 IC3.1 85.98,18.02 83.75,20.25 81.5,20.25 78.75,17.5 78.75,11.9 78,11.15 IC7.2
N$69
  Top 0.254: IC7.29 78,3 78.5,2.5 80.5,2.5 81.25,3.25 85,3.25 85.33,3.58 IC4.7 85.33,5.06 85.77,5.5 86.75,5.5 87.4,4.85 R24.2
N$70  (via drill 0.35)
  Top 0.254: IC3.3 84.68,15.18 84.15,14.65 84,14.65 | 84,14.65 C15.2 82.1,14.5 81,14.5 | IC3.5 84,12.91 84,14.65 | R26.2 C19.1 81,14.5 | 81,14.5 81.25,14.25 v81.25,12.5 | v82,8.25 82.25,8 C16.2 83.15,7.1 84,6.25 | IC4.5 84,4.41 84,6.25 | 84,6.25 84.68,6.93 IC4.3
  Bottom 0.254: v81.25,12.5 81.25,9 v82,8.25
N$71
  Top 0.254: LED1.A 18.65,36.5 R32.1
N$74  (via drill 0.35)
  Top 0.254: IC1.3 84.68,35.68 84.15,35.15 | IC1.5 84,33.41 84,35 84.15,35.15 | IC2.5 84,24.66 84,26.75 | 84.15,35.15 C13.2 81,35.15 | R25.2 C18.1 80.95,35.15 81,35.15 | 81,35.15 81,34 v81.25,33.75 | v81.75,28.5 82.25,28 C14.2 82.65,27.35 83.25,26.75 84,26.75 | IC2.3 84.68,27.43 84,26.75
  Bottom 0.254: v81.25,33.75 81.75,33.25 v81.75,28.5
RX
  Top 0.254: TEENSY4.1.37 36,14.65 R29.1
RXD
  Top 0.254: R29.2 37.5,10.65 UART_PWR.2
SCL2  (via drill 0.3)
  Top 0.152: IC6.24 75.5,25.1 75,24.6 v75,24.5 | v72.6,7.95 75.5,5.05 IC7.24 75.5,2.38 74.62,1.5 71,1.5 v62.88,9.62 | TEENSY4.1.38 41.16,12.03 R28.1 52.08,11.07 55.95,11.07 v56,11.12
  Bottom 0.152: v75,24.5 75,22.85 72.6,20.45 v72.6,7.95 | v56,11.12 61.38,11.12 v62.88,9.62
SDA2  (via drill 0.3)
  Top 0.152: IC6.23 75,25.25 74.25,24.5 v74,24.5 | v72.6,7.05 72.85,7.05 75,4.9 IC7.23 75,2.62 74.38,2 71.25,2 v62.6,10.65 | TEENSY4.1.39 42.85,12.88 53.65,12.88 R27.1 54.73,12 v56.38,12
  Bottom 0.152: v74,24.5 74,22.5 72,20.5 72,7.65 v72.6,7.05 | v56.38,12 61.25,12 v62.6,10.65
TX
  Top 0.254: TEENSY4.1.36 32.38,15.73 R30.1
TXD
  Top 0.254: R30.2 34,10.53 UART_PWR.1
VDD  (via drill 0.35)  (1 unrouted)
  Top 0.152: IC7.13 72.5,8.85 76,5.35 IC7.25
  Top 0.254: TEENSY4.1.15 26.65,31.7 23.35,35 R32.2
  Top 0.305: IC6.13 IC6.14 72,31 71.4,30.4 C32.1 C34.1 65.85,30.4 62.25,34 29.03,34 TEENSY4.1.15 | IC7.13 IC7.14 72,9 71.75,8.75 70.2,8.75 C31.1 C33.1 67.35,8.65 v63.38,12.62 | R28.2 54.5,13.72 R27.2 54.62,13.88 TEENSY4.1.46
  Bottom 0.305: TEENSY4.1.46 59.64,13.88 62.12,13.88 v63.38,12.62
VDDA  (via drill 0.35)
  Top 0.254: IC1.8 85.98,31.5 C9.1 | IC4.8 85.98,2.38 85.92,2.33 C12.1 | IC3.8 85.98,11.13 C11.1 | IC2.8 85.98,22.63 C10.1
  Top 0.305: IC7.8 75,11.4 C23.1 73.25,13.15 73.25,15.4 C26.1 73.35,15.65 75.15,15.65 v76.25,16.75 | C25.1 73.35,35.05 C22.1 74.39,34.31 75,33.7 IC6.8 75,30.5 v75.75,29.75 78.5,29.75 79.45,30.7 85.17,30.7 85.98,31.5 | C11.1 86.75,11.9 v86.75,12 | v86.75,21.5 85.75,21.5 | v86.75,4.25 86.75,3.15 85.92,2.33
  Top 0.406: IC5.5 79.9,22.7 C17.1 | C10.1 85.85,21.6 85.75,21.5 82.5,21.5 v81,23
  Top 0.508: C17.1 80.4,23 v81,23
  Bottom 0.305: v75.75,29.75 81,24.5 v81,23 80.5,23 76.25,18.75 v76.25,16.75 | v86.75,21.5 v86.75,12 v86.75,4.25

### Text on the board
tNames: TXD RXD GND GND 5V